# EAGLE design Buhatron (EAGLE 9.2.0)
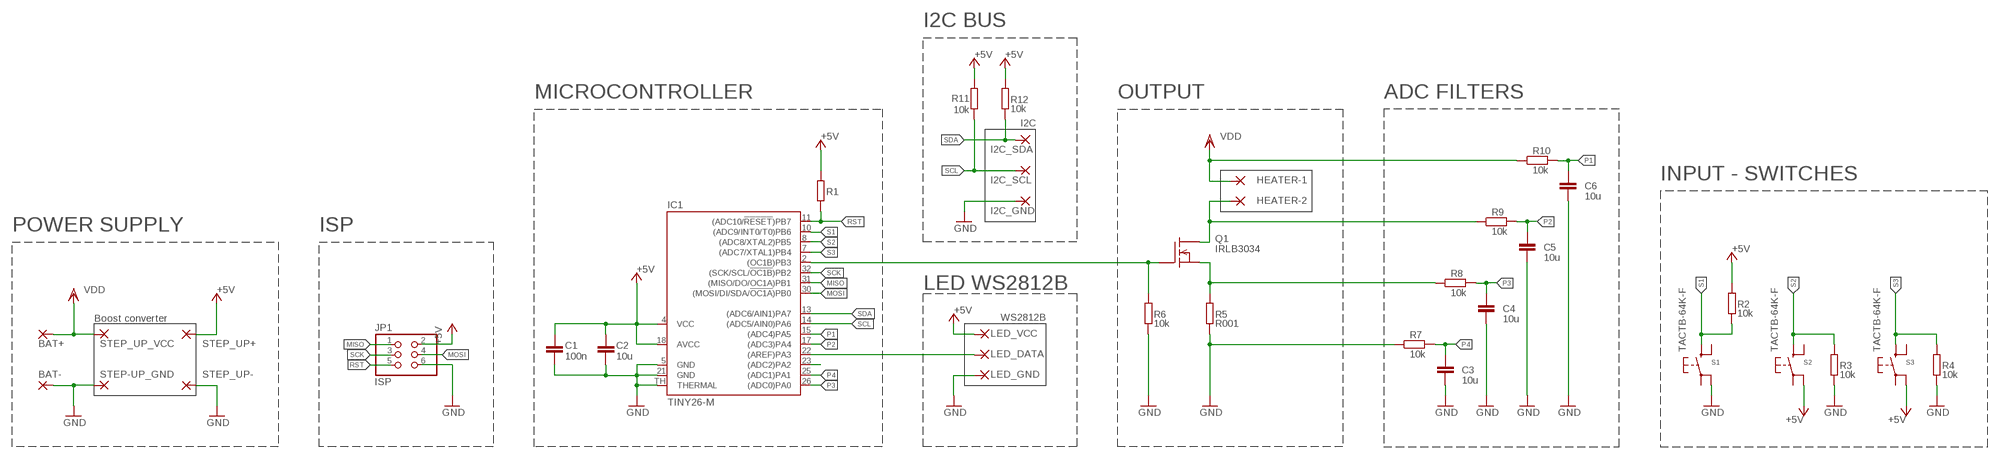
[diagram p0: schematic, sheet 1]

## Parts
BAT+  3,81/1,4  [3,81/1,4]
BAT-  3,81/1,4  [3,81/1,4]
C1  100n  C-EUC0805  [C0805]
C2  10u  C-EUC0805  [C0805]
C3  10u  C-EUC0805  [C0805]
C4  10u  C-EUC0805  [C0805]
C5  10u  C-EUC0805  [C0805]
C6  10u  C-EUC0805  [C0805]
HEATER-1  3,81/1,4  [3,81/1,4]
HEATER-2  3,81/1,4  [3,81/1,4]
I2C_GND  SMD2  [SMD1,27-2,54]
I2C_SCL  SMD2  [SMD1,27-2,54]
I2C_SDA  SMD2  [SMD1,27-2,54]
IC1  TINY26-M  [MLF32-TH]
JP1  ISP  PINHD-2X3  [2X03]
LED_DATA  SMD2  [SMD1,27-2,54]
LED_GND  SMD2  [SMD1,27-2,54]
LED_VCC  SMD2  [SMD1,27-2,54]
Q1  IRLB3034  BUZ11  [TO220]
R1  R-EU_M0805  [M0805]
R2  10k  R-EU_M0805  [M0805]
R3  10k  R-EU_M0805  [M0805]
R4  10k  R-EU_M0805  [M0805]
R5  R001  R-EU_R2512  [R2512]
R6  10k  R-EU_M0805  [M0805]
R7  10k  R-EU_M0805  [M0805]
R8  10k  R-EU_M0805  [M0805]
R9  10k  R-EU_M0805  [M0805]
R10  10k  R-EU_M0805  [M0805]
R11  10k  R-EU_M0805  [M0805]
R12  10k  R-EU_M0805  [M0805]
S1  TACTB-64K-F  [8-4.8_SMD]
S2  TACTB-64K-F  [8-4.8_SMD]
S3  TACTB-64K-F  [8-4.8_SMD]
STEP-UP_GND  3,81/1,4  [3,81/1,4]
STEP_UP+  3,81/1,4  [3,81/1,4]
STEP_UP-  3,81/1,4  [3,81/1,4]
STEP_UP_VCC  3,81/1,4  [3,81/1,4]

## Nets
+5V: C1.1 C2.1 IC1.4(VCC) IC1.18(AVCC) JP1.2 LED_VCC.1(P) R1.2 R2.2 R11.2 R12.2 S2.P$4(G$4) S3.P$4(G$4) STEP_UP+.1(P)
GND: BAT-.1(P) C1.2 C2.2 C3.2 C4.2 C5.2 C6.2 I2C_GND.1(P) IC1.5(GND) IC1.21(GND) IC1.TH(THERMAL) JP1.6 LED_GND.1(P) R3.1 R4.1 R5.1 R6.1 R7.1 S1.P$4(G$4) STEP-UP_GND.1(P) STEP_UP-.1(P)
LED_D: IC1.22((AREF)PA3) LED_DATA.1(P)
MISO: IC1.31((MISO/DO/OC1A)PB1) JP1.1
MOSI: IC1.30((MOSI/DI/SDA/!OC1A!)PB0) JP1.4
N$1: IC1.2((OC1B)PB3) Q1.1(G) R6.2
N$2: Q1.3(S) R5.2 R8.1
N$3: HEATER-2.1(P) Q1.2(D) R9.1
N$8: IC1.23((ADC2)PA2)
P1: C6.1 IC1.15((ADC4)PA5) R10.2
P2: C5.1 IC1.17((ADC3)PA4) R9.2
P3: C4.1 IC1.26((ADC0)PA0) R8.2
P4: C3.1 IC1.25((ADC1)PA1) R7.2
RST: IC1.11((ADC10/!RESET!)PB7) JP1.5 R1.1
S1: IC1.10((ADC9/INT0/T0)PB6) R2.1 S1.P$1(G$1)
S2: IC1.8((ADC8/XTAL2)PB5) R3.2 S2.P$1(G$1)
S3: IC1.7((ADC7/XTAL1)PB4) R4.2 S3.P$1(G$1)
SCK: IC1.32((SCK/SCL/!OC1B!)PB2) JP1.3
SCL: I2C_SCL.1(P) IC1.14((ADC5/AIN0)PA6) R11.1
SDA: I2C_SDA.1(P) IC1.13((ADC6/AIN1)PA7) R12.1
VDD: BAT+.1(P) HEATER-1.1(P) R10.1 STEP_UP_VCC.1(P)
Unconnected: S1.P$2(G$2) S1.P$3(G$3) S2.P$2(G$2) S2.P$3(G$3) S3.P$2(G$2) S3.P$3(G$3)

## Notes on the sheet
- I2C BUS
- MICROCONTROLLER | OUTPUT | ADC FILTERS
- I2C
- INPUT - SWITCHES
- POWER SUPPLY | ISP
- LED WS2812B
- WS2812B
- Boost converter

## Library data of the parts
BAT+ BAT- HEATER-1 HEATER-2 STEP-UP_GND STEP_UP+ STEP_UP- STEP_UP_VCC = wirepad:3,81/1,4: THROUGH-HOLE PAD
C1-C6 = rcl:C-EU: CAPACITOR, European symbol; SPICEPREFIX: C
I2C_GND I2C_SCL I2C_SDA LED_DATA LED_GND LED_VCC = wirepad:SMD2: SMD PAD
IC1 = atmel:TINY26*-M: 8-bit AVR Microcontroller with 2K Bytes Flash Source: http://www.atmel.com .. doc1477.pdf; OC_FARNELL: unknown; OC_NEWARK: unknown
JP1 = pinhead:PINHD-2X3: PIN HEADER; SPICEPREFIX: X
Q1 = transistor-fet:BUZ11: N-Channel Enhancement MOSFET 50V; 30A; 0,040Ohm
R1-R12 = rcl:R-EU_: RESISTOR, European symbol; SPICEPREFIX: R
S1-S3 = Switch_myLbr:TACTB-64K-F

## Board
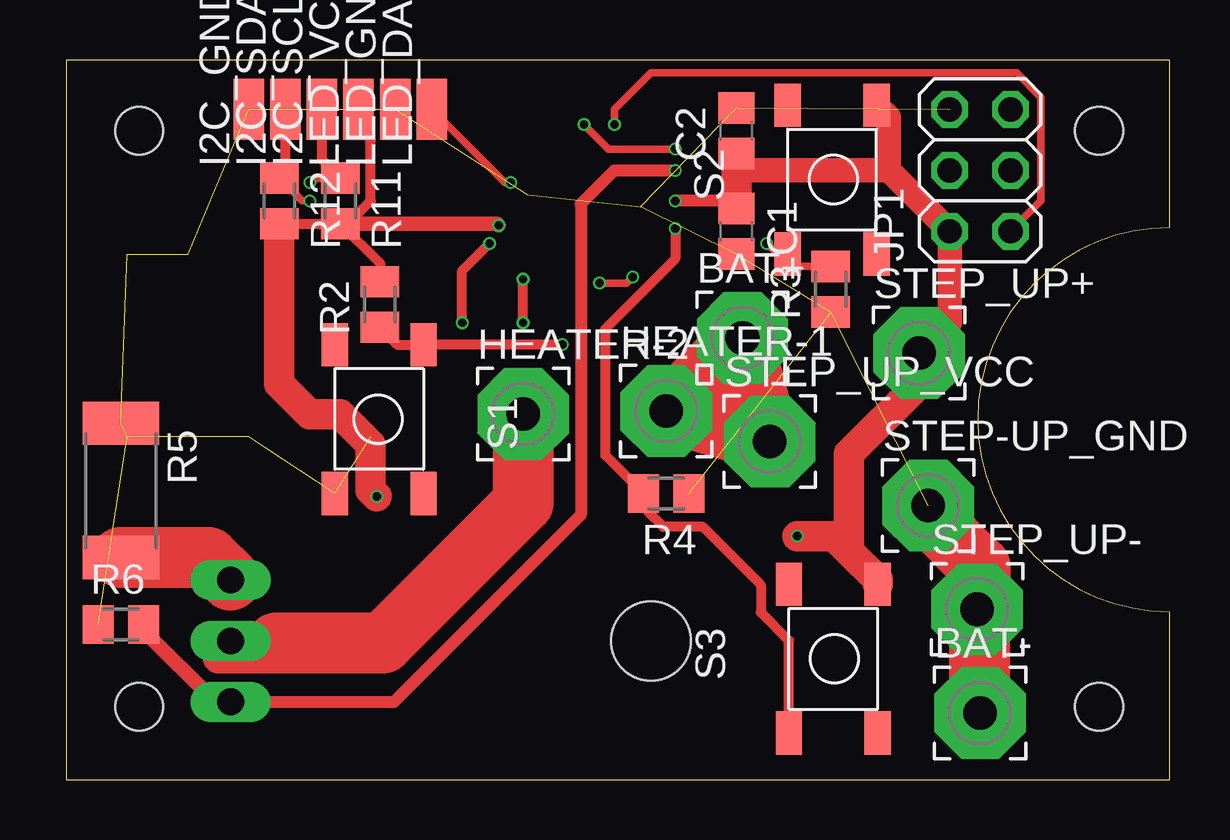
[diagram p1: board, top side]
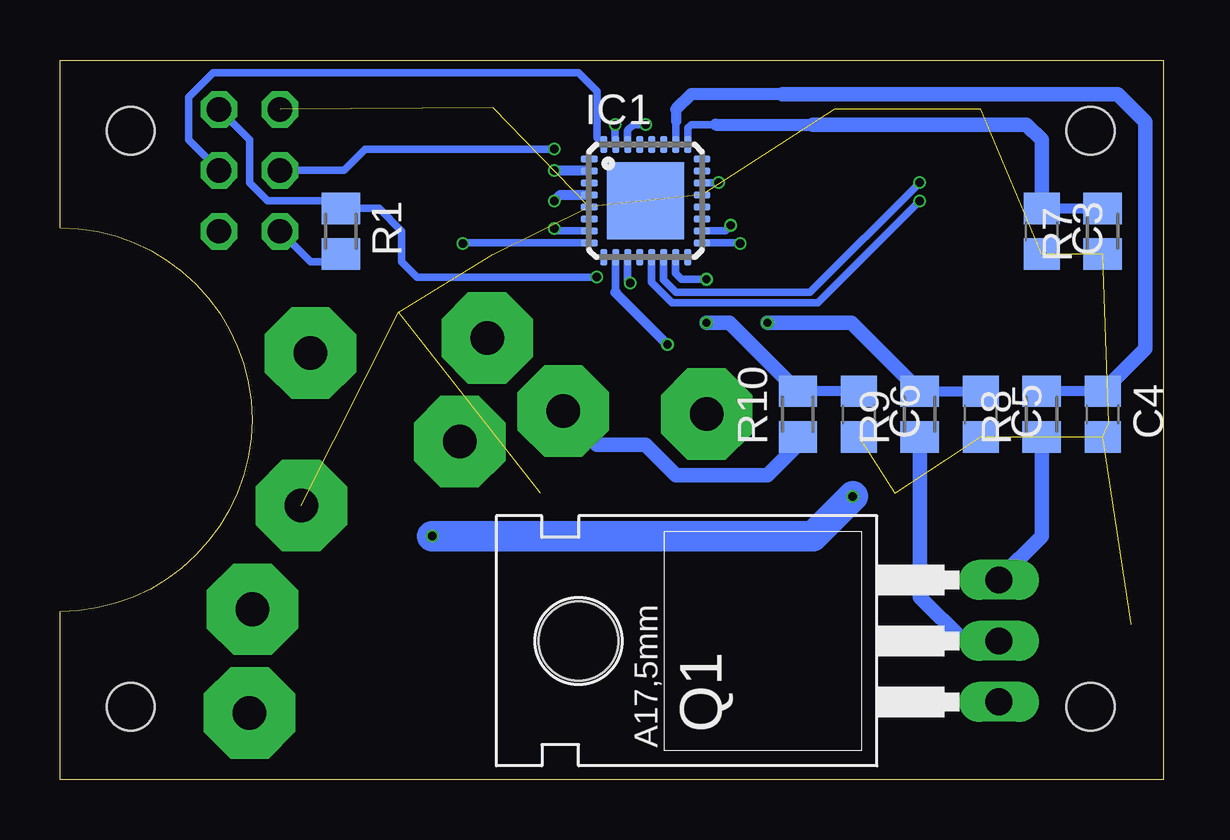
[diagram p2: board, bottom side, seen from below]

Size 46 x 30 mm. Coordinates in mm from the lower left corner, seen from the top.
Outline: 46,30 0,30 0,0 46,0 46,7.01 arc-180 46,23.01 46,30
Copper layers (1*16): Top 0.035559375mm / dielectric 1.6mm / Bottom 0.035559375mm
Design rules "jlcpcb2layer": minimum track width 5mil, minimum drill 12mil, track to track 5mil, track to pad 5mil, pad to pad 5mil, via to via 5mil, smd to smd 5mil, copper to edge 8mil, drill to drill 6mil, minimum pad ring 5mil, minimum via ring 3mil, stop-mask expansion 2.5mil, vias tented up to drill 0mil, thermal gap 10mil
Holes 2 mm at 3.05,27.05 3.05,3.05 43.05,3.05 43.05,27.05

### Footprints (pad centres in the part's own frame; a part is rotated, then mirrored left to right if it is on the bottom)
3,81/1,4 = drill 1.397 pad 3.81 octagon: 1 0,0
C0805 = smd 1.3 x 1.5: 1 -0.95,0; 2 0.95,0
SMD1,27-2,54 = smd 1.27 x 2.54: 1 0,0
MLF32-TH = smd 0.7 x 0.3: 1 -2.35,1.75; 2 -2.35,1.25; 3 -2.35,0.75; 4 -2.35,0.25; 5 -2.35,-0.25; 6 -2.35,-0.75; 7 -2.35,-1.25; 8 -2.35,-1.75; 17 2.35,-1.75; 18 2.35,-1.25; 19 2.35,-0.75; 20 2.35,-0.25; 21 2.35,0.25; 22 2.35,0.75; 23 2.35,1.25; 24 2.35,1.75 | smd 0.3 x 0.7: 9 -1.75,-2.35; 10 -1.25,-2.35; 11 -0.75,-2.35; 12 -0.25,-2.35; 13 0.25,-2.35; 14 0.75,-2.35; 15 1.25,-2.35; 16 1.75,-2.35; 25 1.75,2.35; 26 1.25,2.35; 27 0.75,2.35; 28 0.25,2.35; 29 -0.25,2.35; 30 -0.75,2.35; 31 -1.25,2.35; 32 -1.75,2.35 | smd 3.2 x 3.2: TH 0,0
2X03 = drill 1.016 octagon: 1 -2.54,-1.27; 2 -2.54,1.27; 3 0,-1.27; 4 0,1.27; 5 2.54,-1.27; 6 2.54,1.27
TO220 = drill 1.118 long: 1 -2.54,-6.35; 2 0,-6.35; 3 2.54,-6.35 | hole 3.302: 0,11.176
M0805 = smd 1.3 x 1.6: 1 -0.95,0; 2 0.95,0
R2512 = smd 1.8 x 3.2: 1 -2.8,0; 2 2.8,0
8-4.8_SMD = smd 1.8 x 1.1: P$1 -2.581,2.43; P$2 3.619,2.43; P$3 -2.581,-1.27; P$4 3.619,-1.27

### Placement (x,y rotation side)
BAT+  28.19,18.41 0 top
BAT-  38.1,2.79 0 top
C1  27.94,22.86 270 top
C2  27.94,27.05 90 top
C3  5.08,22.86 270 bottom
C4  2.54,15.24 270 bottom
C5  7.62,15.24 270 bottom
C6  12.7,15.24 270 bottom
HEATER-1  25.02,15.37 0 top
HEATER-2  19.05,15.24 0 top
I2C_GND  7.62,27.94 0 top
I2C_SCL  10.67,27.94 0 top
I2C_SDA  9.14,27.94 0 top
IC1  21.59,24.13 0 bottom
JP1  38.1,25.4 90 top
LED_DATA  15.24,27.94 0 top
LED_GND  13.72,27.94 0 top
LED_VCC  12.19,27.94 0 top
Q1  13.21,5.79 90 bottom
R1  34.29,22.86 270 bottom
R2  13.08,19.81 90 top
R3  31.88,20.45 90 top
R4  25.02,11.94 180 top
R5  2.29,12.06 270 top
R6  2.29,6.48 0 top
R7  2.54,22.86 90 bottom
R8  5.08,15.24 90 bottom
R9  10.16,15.24 90 bottom
R10  15.24,15.24 90 bottom
R11  11.43,24.13 270 top
R12  8.89,24.13 270 top
S1  12.47,15.56 270 top
S2  32.51,24.5 90 top
S3  32.56,4.53 90 top
STEP-UP_GND  35.94,11.43 0 top
STEP_UP+  35.56,17.78 0 top
STEP_UP-  37.97,7.11 0 top
STEP_UP_VCC  29.34,14.1 0 top

### Tracks (layer width: path | path; a pad name or v marks a point on that pad's centre or on a via)
+5V  (via drill 0.35)
  Top 0.406: R11.2 13.08,21.53 R2.2 | R12.2 R11.2 | R11.2 11.75,23.18 12.7,24.13 12.7,26.67 12.32,27.05 12.19,27.05 LED_VCC.1
  Top 0.508: C1.1 27.62,24.13 v25.4,24.13
  Top 0.61: R11.2 17.97,23.18 v18.03,23.11
  Top 1.016: STEP_UP+.1 36.83,19.05 JP1.2 34.29,25.4 | S2.P$4 34.29,27.61 34.29,25.4 | 34.29,25.4 27.94,25.4
  Top 1.27: STEP_UP+.1 35.56,16.51 32.64,13.59 32.64,9.53 | 32.64,9.53 33.83,8.33 S3.P$4 | C1.1 27.94,25.4 C2.1 | 32.64,9.53 32,10.16 v30.48,10.16 | v12.95,11.81 12.7,12.06 12.7,13.97 11.43,15.24 10.16,15.24 8.89,16.51 R12.2
  Bottom 0.305: JP1.2 35.56,21.59 34.61,21.59 R1.2 | v18.03,23.11 18.27,22.88 IC1.18
  Bottom 0.406: v25.4,24.13 25.15,24.38 IC1.4
  Bottom 1.27: v30.48,10.16 14.61,10.16 v12.95,11.81
GND  (18 unrouted)
  Top 2.54: STEP-UP_GND.1 35.94,11.05 38.1,8.89 38.1,7.24 | 38.1,7.24 STEP_UP-.1 | BAT-.1 38.1,7.24
LED_D  (via drill 0.35)
  Top 0.305: v18.54,24.89 18.29,24.89 LED_DATA.1
  Bottom 0.305: IC1.22 19.23,24.89 v18.54,24.89
MISO  (via drill 0.35)
  Top 0.305: JP1.1 40.64,24.13 40.64,28.45 39.62,29.46 24.38,29.46 22.86,27.94 v22.86,27.3
  Bottom 0.305: v22.86,27.3 22.86,26.5 IC1.31
MOSI  (via drill 0.35)
  Top 0.305: v25.4,26.29 22.61,26.29 v21.59,27.3
  Bottom 0.305: JP1.4 34.16,25.4 33.27,26.29 v25.4,26.29 | v21.59,27.3 22.1,27.3 22.32,27.09 22.32,27.08 22.35,27.05 IC1.30
N$1  (via drill 0.35)
  Top 0.508: Q1.1 13.66,3.25 21.46,11.05 21.46,24 22.86,25.4 v25.4,25.4
  Top 0.61: R6.2 3.24,6.22 6.21,3.25 Q1.1
  Bottom 0.406: v25.4,25.4 24.38,25.4 | 24.38,25.4 | 24.38,25.4 23.96,25.4 IC1.2
N$2
  Top 2.54: Q1.3 5.92,9.27 R5.2
  Bottom 0.61: Q1.3 6.86,8.38 5.08,10.16 R8.1
N$3
  Top 1.27: Q1.2 6.86,5.59 6.35,5.08 8.89,5.08 8,5.97 | 8,5.97 7.62,5.97 | 8,5.97 8.51,5.97 8.76,5.71
  Top 2.54: HEATER-2.1 19.05,11.56 13.21,5.71 8.76,5.71
  Bottom 0.61: Q1.2 8.33,5.79 10.16,7.62 R9.1
P1  (via drill 0.35)
  Top 0.406: v19.05,19.05 v19.05,20.86
  Bottom 0.305: v19.05,20.86 20.1,20.86 20.34,21.1 IC1.15
  Bottom 0.406: C6.1 R10.2
  Bottom 0.61: R10.2 18.1,19.05 v19.05,19.05
P2  (via drill 0.35)
  Top 0.406: v16.51,19.05 16.51,21.21 v17.65,22.35
  Bottom 0.305: v17.65,22.35 17.68,22.38 IC1.17
  Bottom 0.406: R9.2 C5.1
  Bottom 0.61: R9.2 13.02,19.05 v16.51,19.05
P3
  Bottom 0.305: 20.32,27.43 20.32,26.5 IC1.26
  Bottom 0.406: C4.1 R8.2 | 20.32,27.94 20.32,27.43
  Bottom 0.508: 15.88,28.57 19.68,28.57 20.32,27.94
  Bottom 0.61: C4.1 0.76,17.97 0.76,27.43 1.91,28.57 15.88,28.57
P4
  Bottom 0.305: 18.67,27.3 19.68,27.3 19.81,27.18 19.81,26.51 IC1.25
  Bottom 0.406: C3.1 R7.2
  Bottom 0.508: 18.67,27.3 14.61,27.3
  Bottom 0.61: C3.1 5.08,26.67 5.71,27.3 14.61,27.3
RST  (via drill 0.35)
  Top 0.305: v23.62,20.95 23.37,20.7 v22.23,20.7
  Bottom 0.305: JP1.5 38.1,26.67 38.1,24.89 37.34,24.13 34.61,24.13 R1.1 32.7,23.81 31.75,22.86 31.75,21.59 31.11,20.95 v23.62,20.95 | IC1.11 22.34,20.81 v22.23,20.7
S1  (via drill 0.35)
  Top 0.406: v20.68,18.14 S1.P$1 13.8,18.14 R2.1
  Bottom 0.305: 22.84,20.34 IC1.10
  Bottom 0.406: v20.68,18.14 22.86,20.32 22.84,20.34
S2  (via drill 0.35)
  Top 0.305: v29.21,22.35 29.64,21.92 S2.P$1 30.6,21.4 R3.2
  Bottom 0.305: IC1.8 29.18,22.38 v29.21,22.35
S3  (via drill 0.35)
  Top 0.406: S3.P$1 30.13,5.81 28.96,6.99 28.96,8.13 26.54,10.54 24.89,10.54 24.26,11.18 24.26,11.75 R4.2 22.48,13.53 22.48,18.8 25.4,21.72 v25.4,22.97
  Bottom 0.305: IC1.7 25.31,22.88 v25.4,22.97
SCK
  Bottom 0.305: JP1.3 40.64,26.67 40.64,28.45 39.62,29.46 24.38,29.46 23.62,28.7 23.62,26.76 IC1.32
SCL  (via drill 0.35)
  Top 0.305: R11.1 10.35,25.08 v10.16,24.89
  Top 0.406: R11.1 10.67,25.84 I2C_SCL.1
  Bottom 0.305: v10.16,24.89 14.73,20.32 20.32,20.32 20.84,20.84 IC1.14
SDA  (via drill 0.35)
  Top 0.305: R12.1 9.84,24.13 v10.16,24.13
  Top 0.406: R12.1 9.14,25.33 I2C_SDA.1
  Bottom 0.305: v10.16,24.13 14.4,19.89 20.5,19.89 21.34,20.73 IC1.13
VDD
  Top 2.54: STEP_UP_VCC.1 BAT+.1 HEATER-1.1 STEP_UP_VCC.1
  Bottom 0.61: HEATER-1.1 23.62,13.97 21.59,13.97 20.32,12.7 16.51,12.7 15.24,13.97 R10.1